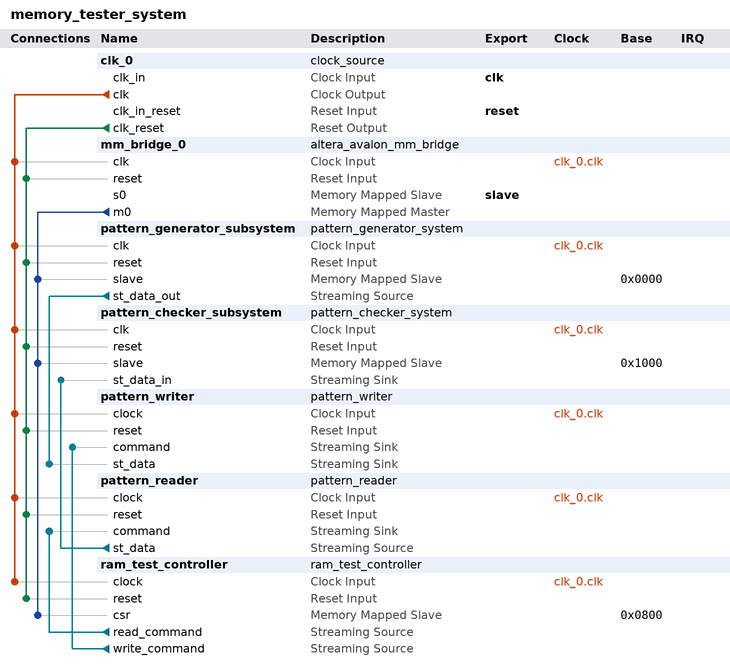
[diagram p0: system contents]
# Platform Designer (Qsys) system memory_tester_system
# Parameters at their usual value, and those the tool derives, are not listed.
package require -exact qsys 11.0
create_system memory_tester_system
set_project_property DEVICE_FAMILY CYCLONEIII

add_instance clk_0 clock_source 11.0
set_instance_parameter_value clk_0 clockFrequency 50000000
set_instance_parameter_value clk_0 clockFrequencyKnown false

add_instance mm_bridge_0 altera_avalon_mm_bridge 11.0
set_instance_parameter_value mm_bridge_0 DATA_WIDTH 32
set_instance_parameter_value mm_bridge_0 ADDRESS_WIDTH 13
set_instance_parameter_value mm_bridge_0 ADDRESS_UNITS SYMBOLS
set_instance_parameter_value mm_bridge_0 MAX_PENDING_RESPONSES 4

add_instance pattern_generator_subsystem pattern_generator_system 1.0

add_instance pattern_checker_subsystem pattern_checker_system 1.0

add_instance pattern_writer pattern_writer 1.1
set_instance_parameter_value pattern_writer MAX_BURST_COUNT 2
set_instance_parameter_value pattern_writer LENGTH_WIDTH 21
set_instance_parameter_value pattern_writer DATA_WIDTH 32
set_instance_parameter_value pattern_writer BURST_REALIGN_ENABLE 1
set_instance_parameter_value pattern_writer ADDRESS_WIDTH 32
set_instance_parameter_value pattern_writer FIFO_DEPTH 128
set_instance_parameter_value pattern_writer BURST_ENABLE 1

add_instance pattern_reader pattern_reader 1.1
set_instance_parameter_value pattern_reader MAX_BURST_COUNT 2
set_instance_parameter_value pattern_reader LENGTH_WIDTH 21
set_instance_parameter_value pattern_reader DATA_WIDTH 32
set_instance_parameter_value pattern_reader BURST_REALIGN_ENABLE 1
set_instance_parameter_value pattern_reader ADDRESS_WIDTH 32
set_instance_parameter_value pattern_reader FIFO_DEPTH 128
set_instance_parameter_value pattern_reader BURST_ENABLE 1

add_instance ram_test_controller ram_test_controller 1.1
set_instance_parameter_value ram_test_controller DEFAULT_BLOCK_SIZE 1024
set_instance_parameter_value ram_test_controller DEFAULT_TRAIL_DISTANCE 1
set_instance_parameter_value ram_test_controller DEFAULT_TIMER_RESOLUTION 10
set_instance_parameter_value ram_test_controller CLOCK_SPEED 0

# connections
add_connection clk_0.clk mm_bridge_0.clk clock
add_connection clk_0.clk pattern_checker_subsystem.clk clock
add_connection clk_0.clk pattern_generator_subsystem.clk clock
add_connection clk_0.clk pattern_reader.clock clock
add_connection clk_0.clk pattern_writer.clock clock
add_connection clk_0.clk ram_test_controller.clock clock
add_connection clk_0.clk_reset mm_bridge_0.reset reset
add_connection clk_0.clk_reset pattern_checker_subsystem.reset reset
add_connection clk_0.clk_reset pattern_generator_subsystem.reset reset
add_connection clk_0.clk_reset pattern_reader.reset reset
add_connection clk_0.clk_reset pattern_writer.reset reset
add_connection clk_0.clk_reset ram_test_controller.reset reset
add_connection mm_bridge_0.m0 pattern_checker_subsystem.slave avalon
set_connection_parameter_value mm_bridge_0.m0/pattern_checker_subsystem.slave baseAddress 0x1000
add_connection mm_bridge_0.m0 pattern_generator_subsystem.slave avalon
set_connection_parameter_value mm_bridge_0.m0/pattern_generator_subsystem.slave baseAddress 0x0000
add_connection mm_bridge_0.m0 ram_test_controller.csr avalon
set_connection_parameter_value mm_bridge_0.m0/ram_test_controller.csr baseAddress 0x0800
add_connection pattern_generator_subsystem.st_data_out pattern_writer.st_data avalon_streaming
add_connection pattern_reader.st_data pattern_checker_subsystem.st_data_in avalon_streaming
add_connection ram_test_controller.read_command pattern_reader.command avalon_streaming
add_connection ram_test_controller.write_command pattern_writer.command avalon_streaming

# exported interfaces
add_interface clk clock sink
set_interface_property clk EXPORT_OF clk_0.clk_in
add_interface reset reset sink
set_interface_property reset EXPORT_OF clk_0.clk_in_reset
add_interface slave avalon slave
set_interface_property slave EXPORT_OF mm_bridge_0.s0

save_system memory_tester_system.qsys
